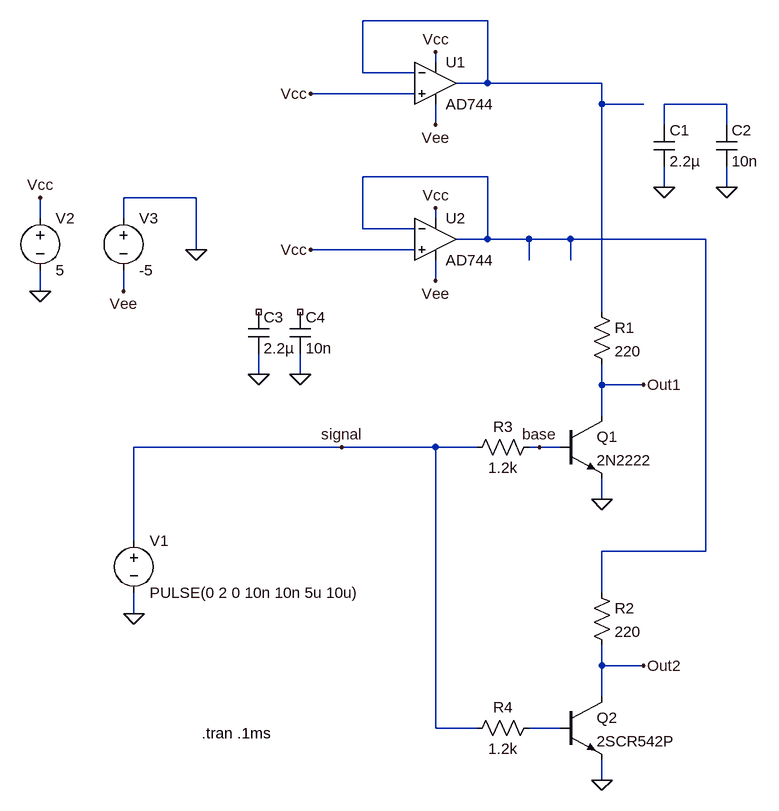
[diagram p0: schematic AOP1.asc]
AOP1.asc, the LTspice schematic file:
Version 4
SHEET 1 880 1268
WIRE 288 80 96 80
WIRE 208 144 208 128
WIRE 96 160 96 80
WIRE 176 160 96 160
WIRE 288 176 288 80
WIRE 288 176 240 176
WIRE 464 176 288 176
WIRE 176 192 16 192
WIRE 464 208 464 176
WIRE 528 208 464 208
WIRE 656 208 560 208
WIRE 208 240 208 208
WIRE 560 240 560 208
WIRE 656 240 656 208
WIRE 288 320 96 320
WIRE 560 336 560 304
WIRE 656 336 656 304
WIRE -160 352 -272 352
WIRE -400 384 -400 352
WIRE -272 384 -272 352
WIRE 208 384 208 368
WIRE 96 400 96 320
WIRE 176 400 96 400
WIRE 288 416 288 320
WIRE 288 416 240 416
WIRE 352 416 288 416
WIRE 416 416 352 416
WIRE 624 416 416 416
WIRE -160 432 -160 352
WIRE 176 432 16 432
WIRE 352 448 352 416
WIRE 416 448 416 416
WIRE 208 480 208 448
WIRE -400 496 -400 464
WIRE -272 496 -272 464
WIRE 464 528 464 208
WIRE -64 624 -64 592
WIRE 0 624 0 592
WIRE 464 640 464 608
WIRE 528 640 464 640
WIRE 464 688 464 640
WIRE 64 736 -256 736
WIRE 208 736 64 736
WIRE 272 736 208 736
WIRE 368 736 352 736
WIRE 400 736 368 736
WIRE 464 816 464 784
WIRE -256 880 -256 736
WIRE 624 896 624 416
WIRE 624 896 464 896
WIRE 464 960 464 896
WIRE -256 992 -256 960
WIRE 464 1072 464 1040
WIRE 528 1072 464 1072
WIRE 464 1120 464 1072
WIRE 208 1168 208 736
WIRE 272 1168 208 1168
WIRE 400 1168 352 1168
WIRE 464 1248 464 1216
FLAG -160 432 0
FLAG -400 496 0
FLAG -256 992 0
FLAG -400 352 Vcc
FLAG 208 128 Vcc
FLAG -272 496 Vee
FLAG 208 240 Vee
FLAG 16 192 Vcc
FLAG 208 368 Vcc
FLAG 208 480 Vee
FLAG 16 432 Vcc
FLAG 464 816 0
FLAG 464 1248 0
FLAG 528 640 Out1
FLAG 528 1072 Out2
FLAG 560 336 0
FLAG 656 336 0
FLAG 0 624 0
FLAG -64 624 0
FLAG 64 736 signal
FLAG 368 736 base
SYMBOL OpAmps\\AD744 208 112 R0
SYMATTR InstName U1
SYMBOL voltage -256 864 R0
WINDOW 123 0 0 Left 0
WINDOW 39 0 0 Left 0
SYMATTR InstName V1
SYMATTR Value PULSE(0 2 0 10n 10n 5u 10u)
SYMBOL voltage -400 368 R0
WINDOW 123 0 0 Left 0
WINDOW 39 0 0 Left 0
SYMATTR InstName V2
SYMATTR Value 5
SYMBOL voltage -272 368 R0
WINDOW 123 0 0 Left 0
WINDOW 39 0 0 Left 0
SYMATTR InstName V3
SYMATTR Value -5
SYMBOL OpAmps\\AD744 208 352 R0
SYMATTR InstName U2
SYMBOL npn 400 688 R0
SYMATTR InstName Q1
SYMATTR Value 2N2222
SYMBOL npn 400 1120 R0
SYMATTR InstName Q2
SYMATTR Value 2SCR542P
SYMBOL res 448 512 R0
SYMATTR InstName R1
SYMATTR Value 220
SYMBOL res 448 944 R0
SYMATTR InstName R2
SYMATTR Value 220
SYMBOL res 368 720 R90
WINDOW 0 0 56 VBottom 2
WINDOW 3 32 56 VTop 2
SYMATTR InstName R3
SYMATTR Value 1.2k
SYMBOL res 368 1152 R90
WINDOW 0 0 56 VBottom 2
WINDOW 3 32 56 VTop 2
SYMATTR InstName R4
SYMATTR Value 1.2k
SYMBOL cap 544 240 R0
SYMATTR InstName C1
SYMATTR Value 2.2µ
SYMBOL cap 640 240 R0
SYMATTR InstName C2
SYMATTR Value 10n
SYMBOL cap -80 528 R0
SYMATTR InstName C3
SYMATTR Value 2.2µ
SYMBOL cap -16 528 R0
SYMATTR InstName C4
SYMATTR Value 10n
TEXT -152 1176 Left 2 !.tran .1ms

The netlist it stands for:
* AOP1.asc
XU1 Vcc N001 Vcc Vee N001 AD744  ; pins In+ In- V+ V- OUT
V1 signal 0 PULSE(0 2 0 10n 10n 5u 10u)
V2 Vcc 0 5
V3 0 Vee -5
XU2 Vcc N003 Vcc Vee N003 AD744  ; pins In+ In- V+ V- OUT
Q1 Out1 base 0 0 2N2222
Q2 Out2 N004 0 0 2SCR542P
R1 N001 Out1 220
R2 N003 Out2 220
R3 base signal 1.2k
R4 N004 signal 1.2k
C1 N002 0 2.2µ
C2 N002 0 10n
C3 NC_01 0 2.2µ
C4 NC_02 0 10n
.model NPN NPN
.model PNP PNP
.lib standard.bjt
.tran .1ms
.backanno
.end